# EAGLE design Qwiic Twist-BottomJig (EAGLE 9.2.1)
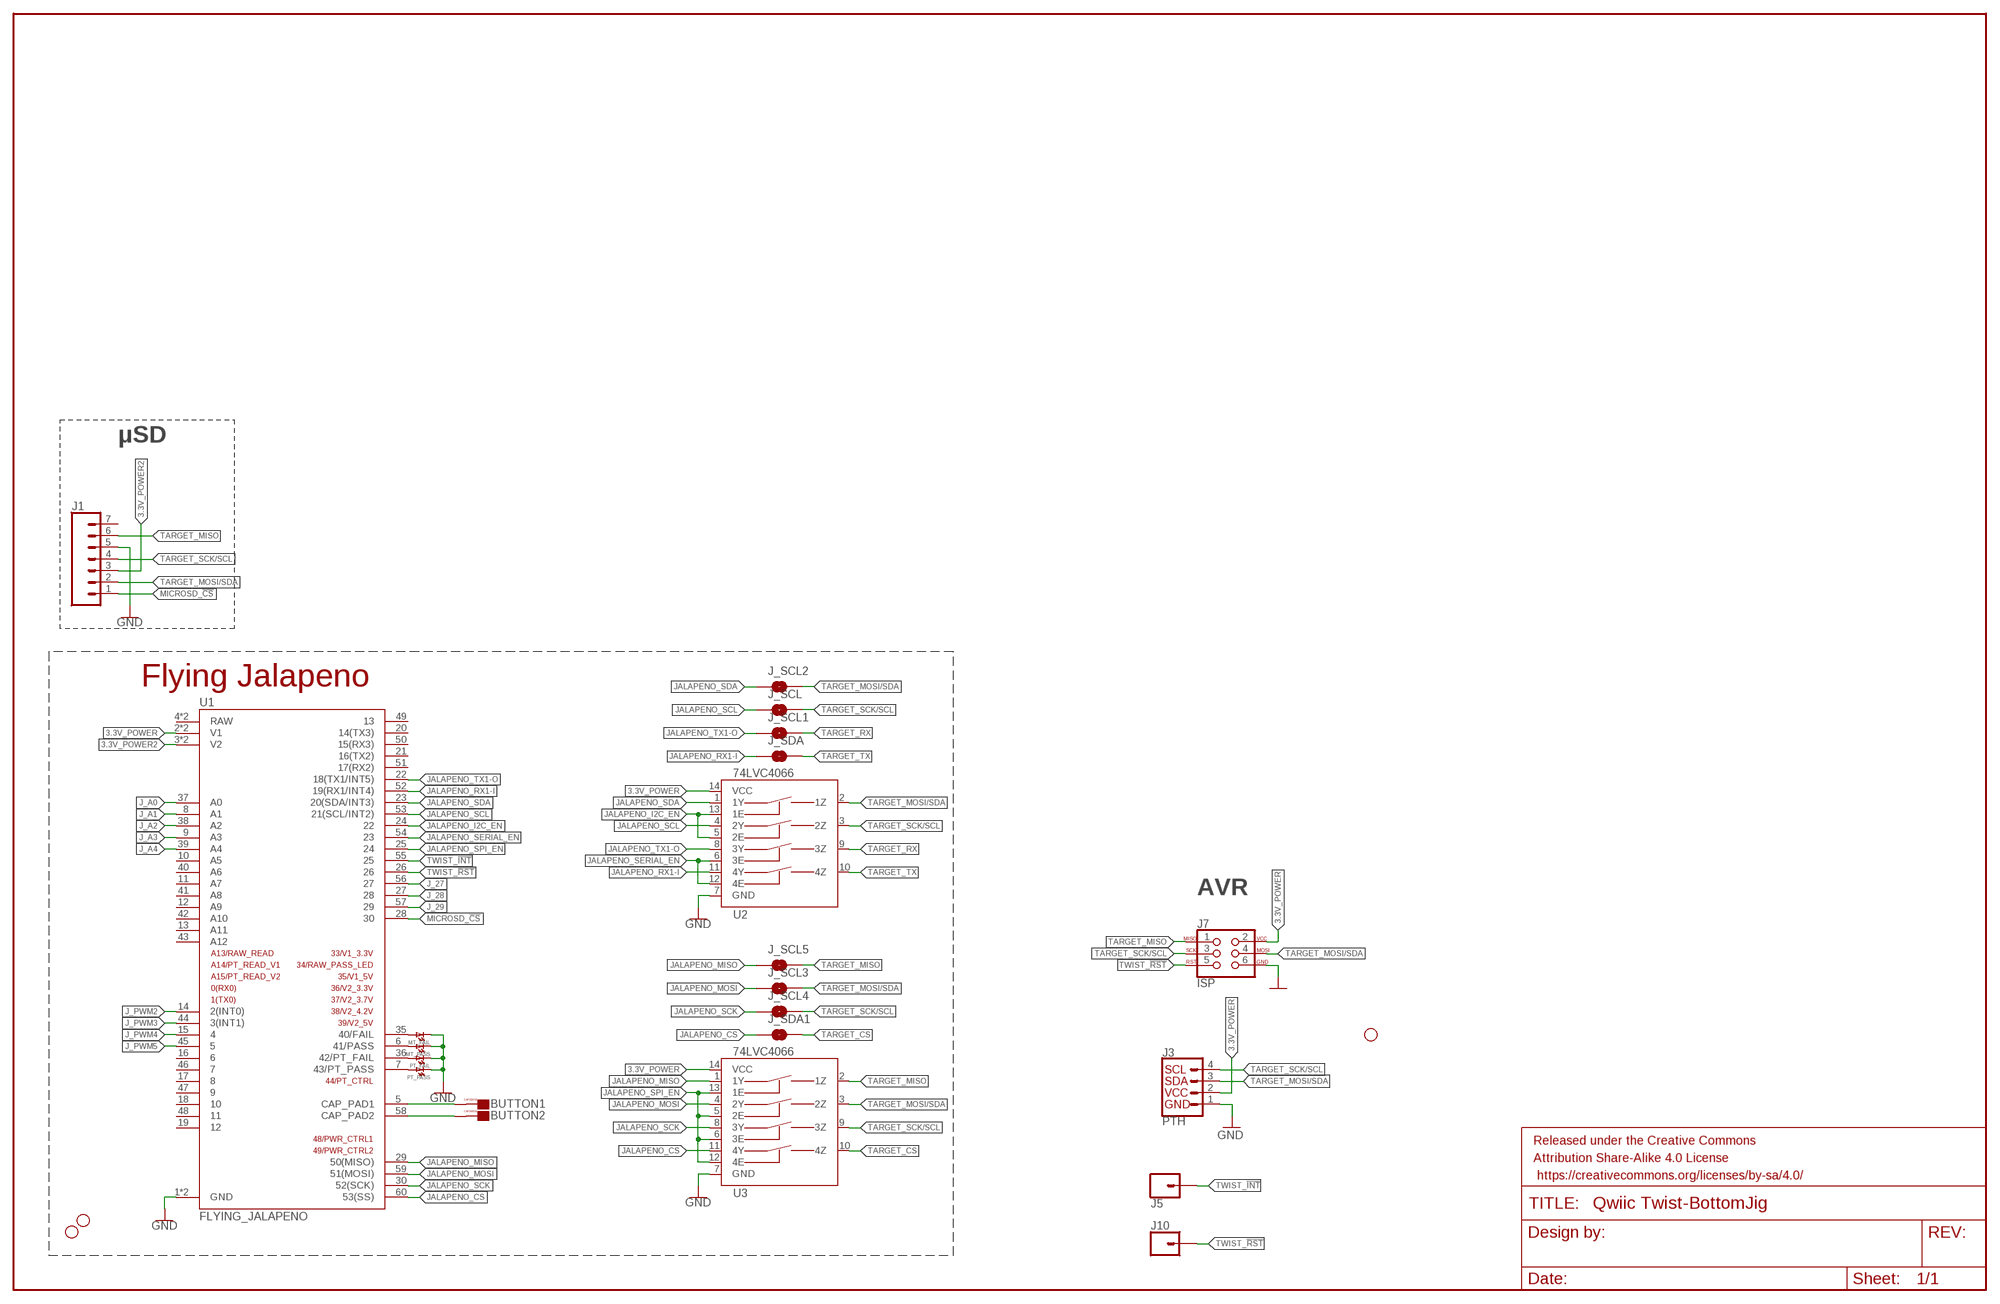
[diagram p0: schematic, sheet 1]

## Parts
BUTTON1  CAPSENSE_BUTTON_PAD_ONLY  [CAPSENSE_BUTTON_PADS_ONLY]
BUTTON2  CAPSENSE_BUTTON_PAD_ONLY  [CAPSENSE_BUTTON_PADS_ONLY]
FRAME2  FRAME-LEDGER  [CREATIVE_COMMONS]
H1  STAND-OFF  [STAND-OFF]
H3  STAND-OFF  [STAND-OFF]
J1  CONN_07  [1X07]
J3  PTH  I2C_STANDARD_NO_SILK  [1X04_NO_SILK]
J5  CONN_01PTH_NO_SILK_YES_STOP  [1X01_NO_SILK]
J7  ISP  AVR_SPI_PROG_3X2NS  [2X3-NS]
J10  CONN_01PTH_NO_SILK_YES_STOP  [1X01_NO_SILK]
J_SCL  JUMPER-SMT_2_NO_NO-SILK  [SMT-JUMPER_2_NO_NO-SILK]
J_SCL1  JUMPER-SMT_2_NO_NO-SILK  [SMT-JUMPER_2_NO_NO-SILK]
J_SCL2  JUMPER-SMT_2_NO_NO-SILK  [SMT-JUMPER_2_NO_NO-SILK]
J_SCL3  JUMPER-SMT_2_NO_NO-SILK  [SMT-JUMPER_2_NO_NO-SILK]
J_SCL4  JUMPER-SMT_2_NO_NO-SILK  [SMT-JUMPER_2_NO_NO-SILK]
J_SCL5  JUMPER-SMT_2_NO_NO-SILK  [SMT-JUMPER_2_NO_NO-SILK]
J_SDA  JUMPER-SMT_2_NO_NO-SILK  [SMT-JUMPER_2_NO_NO-SILK]
J_SDA1  JUMPER-SMT_2_NO_NO-SILK  [SMT-JUMPER_2_NO_NO-SILK]
JP3  STAND-OFF  [STAND-OFF]
MT_FAIL  LED1206  [LED-1206]
MT_PASS  LED1206  [LED-1206]
PT_FAIL  LED1206  [LED-1206]
PT_PASS  LED1206  [LED-1206]
U1  FLYING_JALAPENO  FLYING_JALAPENO_V3MALE  [FLYING_JALAPENO_V3_M]
U2  74LVC4066  74LVC4066_MUX_1:1_X4  [SO14]
U3  74LVC4066  74LVC4066_MUX_1:1_X4  [SO14]

## Nets
3.3V_POWER [VCC]: J3.2(VCC) J7.2 U1.2(V1) U1.32(V1) U2.14(VCC) U3.14(VCC)
3.3V_POWER2 [VCC]: J1.3 U1.3(V2) U1.33(V2)
BUTTON1 [CAPSENSE]: BUTTON1.CAPSENSE_PAD(CAPSENSE) U1.5(CAP_PAD1)
BUTTON2 [CAPSENSE]: BUTTON2.CAPSENSE_PAD(CAPSENSE) U1.58(CAP_PAD2)
GND: J1.5 J3.1(GND) J7.6 MT_FAIL.C MT_PASS.C PT_FAIL.C PT_PASS.C U1.1(GND) U1.31(GND) U2.7(GND) U3.7(GND)
J_27: U1.56
J_28: U1.27
J_29: U1.57
J_A0: U1.37(A0)
J_A1: U1.8(A1)
J_A2: U1.38(A2)
J_A3: U1.9(A3)
J_A4: U1.39(A4)
J_PWM2: U1.14(2(INT0))
J_PWM3: U1.44(3(INT1))
J_PWM4: U1.15
J_PWM5: U1.45
JALAPENO_CS: J_SDA1.1 U1.60(53(SS)) U3.11(4Y)
JALAPENO_I2C_EN: U1.24 U2.5(2E) U2.13(1E)
JALAPENO_MISO: J_SCL5.1 U1.29(50(MISO)) U3.1(1Y)
JALAPENO_MOSI: J_SCL3.1 U1.59(51(MOSI)) U3.4(2Y)
JALAPENO_RX1-I: J_SDA.1 U1.52(19(RX1/INT4)) U2.11(4Y)
JALAPENO_SCK: J_SCL4.1 U1.30(52(SCK)) U3.8(3Y)
JALAPENO_SCL: J_SCL.1 U1.53(21(SCL/INT2)) U2.4(2Y)
JALAPENO_SDA: J_SCL2.1 U1.23(20(SDA/INT3)) U2.1(1Y)
JALAPENO_SERIAL_EN: U1.54 U2.6(3E) U2.12(4E)
JALAPENO_SPI_EN: U1.25 U3.5(2E) U3.6(3E) U3.12(4E) U3.13(1E)
JALAPENO_TX1-O: J_SCL1.1 U1.22(18(TX1/INT5)) U2.8(3Y)
MICROSD_!CS!: J1.1 U1.28
N$1: PT_PASS.A U1.7(43/PT_PASS)
N$2: PT_FAIL.A U1.36(42/PT_FAIL)
N$4: MT_PASS.A U1.6(41/PASS)
N$5: MT_FAIL.A U1.35(40/FAIL)
TARGET_CS: J_SDA1.2 U3.10(4Z)
TARGET_MISO: J1.6 J7.1 J_SCL5.2 U3.2(1Z)
TARGET_MOSI/SDA: J1.2 J3.3(SDA) J7.4 J_SCL2.2 J_SCL3.2 U2.2(1Z) U3.3(2Z)
TARGET_RX: J_SCL1.2 U2.9(3Z)
TARGET_SCK/SCL: J1.4 J3.4(SCL) J7.3 J_SCL4.2 J_SCL.2 U2.3(2Z) U3.9(3Z)
TARGET_TX: J_SDA.2 U2.10(4Z)
TWIST_!INT!: J5.1 U1.55
TWIST_!RST!: J7.5 J10.1 U1.26
Unconnected: J1.7 U1.4(RAW) U1.10(A5) U1.11(A7) U1.12(A9) U1.13(A11) U1.16 U1.17 U1.18 U1.19 U1.20(14(TX3)) U1.21(16(TX2)) U1.34(RAW) U1.40(A6) U1.41(A8) U1.42(A10) U1.43(A12) U1.46 U1.47 U1.48 U1.49 U1.50(15(RX3)) U1.51(17(RX2))

## Notes on the sheet
- μSD
- Flying Jalapeno
- AVR

## Library data of the parts
BUTTON1 BUTTON2 = Testing:CAPSENSE_BUTTON_PAD_ONLY
FRAME2 = SparkFun-Aesthetics:FRAME-LEDGER: Schematic Frame - Ledger Standard 11x14 US Ledger frame
H1 H3 = SparkFun-Hardware:STAND-OFF: Stand Off
J1 = SparkFun-Connectors:CONN_07: Multi connection point. Often used as Generic Header-pin footprint for 0.1 inch spaced/style header connections On any of the 0.1 inch spaced packages, you can populate with these: Break Away Headers - Straight <https://www.sparkfun.com/products/116> (PRT-00116) Break Away Male Headers - Right Angle <https://www.sparkfun.com/products/553> (PRT-00553) Female Headers <https://www.sparkfun.com/products/115> (PRT-00115) Break Away Headers - Machine Pin <https://www.sparkfun.com/products/117> (PRT-00117) Break Away Female Headers - Swiss Machine Pin <https://www.sparkfun.com/products/743> (PRT-00743) For SCREWTERMINALS and SPRING TERMINALS visit here: Screw Terimnals on SparkFun.com <https://www.sparkfun.com/search/results?term=Screw+Terminals> (5mm/3.5mm/2.54mm spacing) This device is also useful as a general connection point to wire up your design to another part of your project. Our various solder wires solder well into these plated through hole pads. Hook-Up Wire - Assortment (Stranded, 22 AWG) <https://www.sparkfun.com/products/11375> (PRT-11375) Hook-Up Wire - Assortment (Solid Core, 22 AWG) <https://www.sparkfun.com/products/11367> (PRT-11367) View the entire wire category on our website here <https://www.sparkfun.com/categories/141> Special notes: Molex polarized connector foot print use with SKU : PRT-08231 with associated crimp pins and housings. 1MM SMD Version SKU: PRT-10208 NOTES ON THE VARIANTS LOCK and LOCK_LONGPADS... This footprint was designed to help hold the alignment of a through-hole component (i.e. 6-pin header) while soldering it into place. You may notice that each hole has been shifted either up or down by 0.005 of an inch from it's more standard position (which is a perfectly straight line). This slight alteration caused the pins (the squares in the middle) to touch the edges of the holes. Because they are alternating, it causes a "brace" to hold the component in place. 0.005 has proven to be the perfect amount of "off-center" position when using our standard breakaway headers. Although looks a little odd when you look at the bare footprint, once you have a header in there, the alteration is very hard to notice. Also,if you push a header all the way into place, it is covered up entirely on the bottom side.
J3 = SparkX:I2C_STANDARD: SparkFun I2C Standard Pinout Header SparkFun has standardized on a pinout for all I2C based sensor breakouts. This pinout allows I2C boards to be plugged directly into the headers on Arduino Uno compatible boards, and to be daisy chained easily. Example SparkFun Products: SparkFun Atmospheric Sensor Breakout - BME280 <https://www.sparkfun.com/products/13676> SparkFun Altitude/Pressure Sensor Breakout - MPL3115A2 <https://www.sparkfun.com/products/11084> SparkFun TOF Range Finder Sensor - VL6180 <https://www.sparkfun.com/products/12785>
J5 J10 = SparkFun-Connectors:CONN_01: Single connection point. Often used as Generic Header-pin footprint for 0.1 inch spaced/style header connections On any of the 0.1 inch spaced packages, you can populate with these: Break Away Headers - Straight <https://www.sparkfun.com/products/116> (PRT-00116) Break Away Male Headers - Right Angle <https://www.sparkfun.com/products/553> (PRT-00553) Female Headers <https://www.sparkfun.com/products/115> (PRT-00115) Break Away Headers - Machine Pin <https://www.sparkfun.com/products/117> (PRT-00117) Break Away Female Headers - Swiss Machine Pin <https://www.sparkfun.com/products/743> (PRT-00743) This device is also useful as a general connection point to wire up your design to another part of your project. Our various solder wires solder well into these plated through hole pads. Hook-Up Wire - Assortment (Stranded, 22 AWG) <https://www.sparkfun.com/products/11375> (PRT-11375) Hook-Up Wire - Assortment (Solid Core, 22 AWG) <https://www.sparkfun.com/products/11367> (PRT-11367) View the entire wire category on our website here <https://www.sparkfun.com/categories/141> Special notes: SMTSO-256-ET is a "flush mount" nut for a 4-40 screw. We mostly use this on specialty testbeds; it is a nice way to connect hardware to your PCB at an adjustable hieght. Also note, the SNAP packages are for using a snappable style connector. We sell a baggie of snaps and they are also used on two LilyPad designs: Snap Assortment - 30 pack (male and female) <https://www.sparkfun.com/products/11347> (DEV-11347) LilyPad Arduino SimpleSnap <https://www.sparkfun.com/products/10941> (DEV-10941) LilyPad SimpleSnap Protoboard <https://www.sparkfun.com/products/10940> (DEV-10940)
J7 = SparkFun-Connectors:AVR_SPI_PROG_3X2: AVR ISP 6 Pin This is the reduced ISP connector for AVR programming. Common on Arduino. This footprint will take up less PCB space and can be used with a 10-pin to 6-pin adapter such as SKU: BOB-08508 **Special note about "TEST_POINT" package. The stop mask is on the top side, so if you want your programming test points to be on the bottom of your board, make sure to place this package on the bottom side of the board. This also ensure that the orientation to program from the bottom side will be correct. SparkFun Products: SparkFun ISP Pogo Adapter <https://www.sparkfun.com/products/11591> - NS Tiny AVR Programmer <https://www.sparkfun.com/products/11801> -PTH
J_SCL J_SCL1-J_SCL5 J_SDA J_SDA1 = SparkFun-Jumpers:JUMPER-SMT_2_NO: Normally open jumper This jumper has two pads in close proximity to each other. Apply solder to close the connection. Round pads are easier to solder for beginners, but are a lot larger. SparkFun Product that uses the round pads: SparkFun EL Sequencer <https://www.sparkfun.com/products/12781>
JP3 = SparkFun:STAND-OFF: Stand Off
MT_FAIL MT_PASS PT_FAIL PT_PASS = Testing:LED: LEDs Standard schematic elements and footprints for 5mm, 3mm, 1206, and 0603 sized LEDs. 5mm - Spark Fun Electronics SKU : COM-00529 (and others)
U1 = Testing:FLYING_JALAPENO_V3
U2 U3 = Testing:74LVC4066_MUX_1:1_X4

## Net classes
1 VCC: width 0.381 mm
2 POWA: width 0.61 mm
3 CAPSENSE: width 0.508 mm

## Board
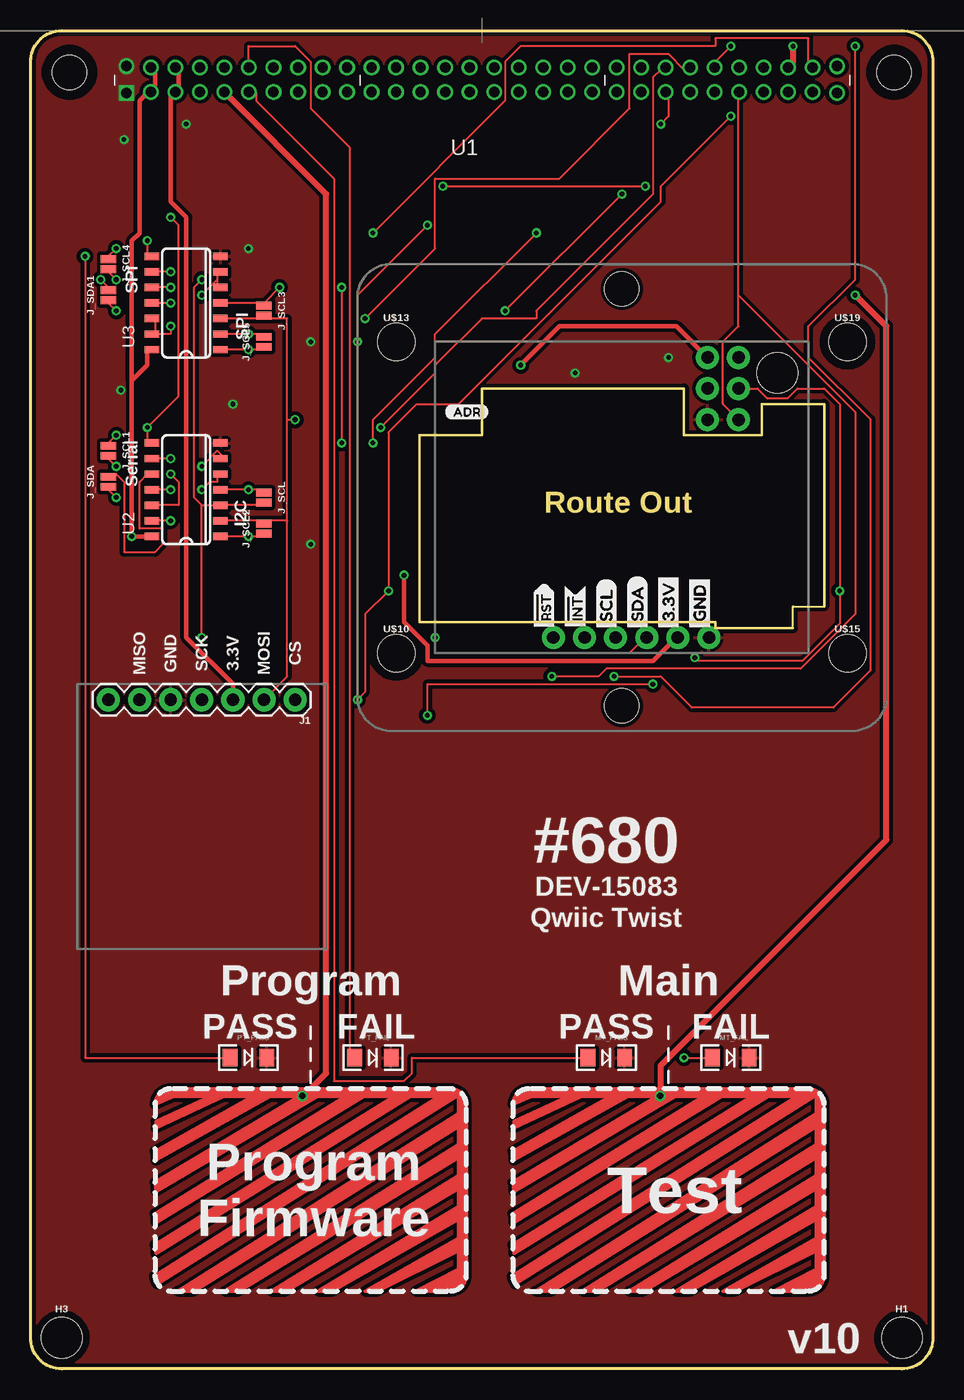
[diagram p1: board, top side]
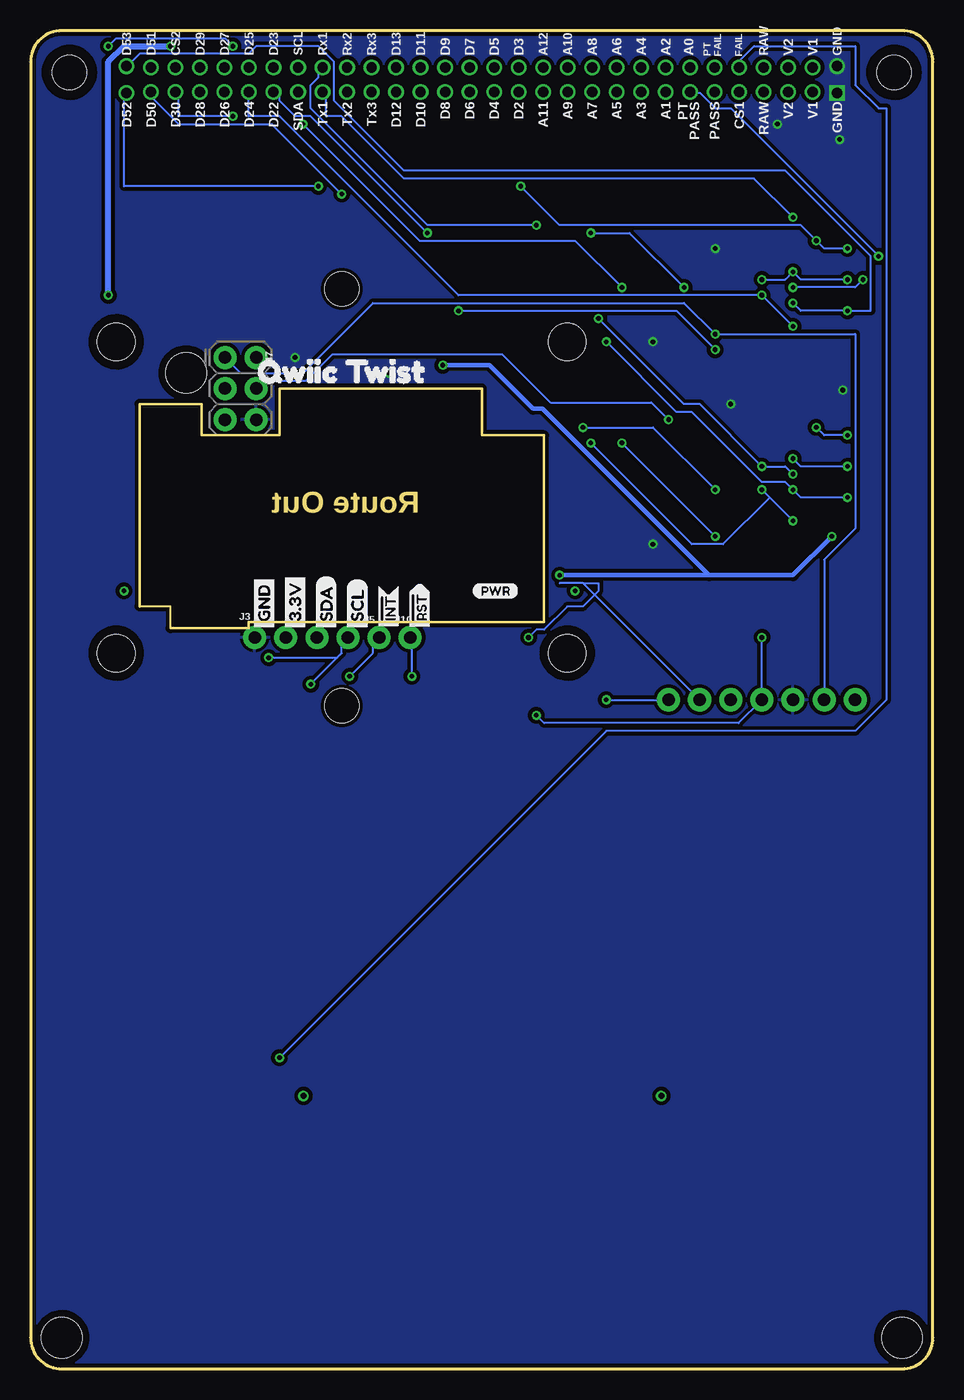
[diagram p2: board, bottom side, seen from below]

Size 73.66 x 109.22 mm. Coordinates in mm from the lower left corner, seen from the top.
Outline: 2.54,109.22 71.12,109.22 arc-90 73.66,106.68 73.66,2.54 arc-90 71.12,0 2.54,0 arc-90 0,2.54 0,106.68 arc-90 2.54,109.22
Outline: 31.75,76.2 36.83,76.2 36.83,80.01 53.34,80.01 53.34,76.2 59.69,76.2 59.69,78.74 64.77,78.74 64.77,62.23 62.23,62.23 62.23,60.45 55.88,60.45 55.88,60.96 31.75,60.96 31.75,76.2
Copper layers (1*16): Top 0.035mm / dielectric 1.5mm / Bottom 0.035mm
Design rules "SparkFun-2-layer-TIGHT": minimum track width 7mil, minimum drill 15mil, track to track 7mil, track to pad 7mil, pad to pad 7mil, via to via 7mil, smd to smd 7mil, copper to edge 7mil, drill to drill 7mil, minimum pad ring 7mil, minimum via ring 7mil, stop-mask expansion 4mil, vias tented up to drill 25mil, thermal gap 10mil

### Footprints (pad centres in the part's own frame; a part is rotated, then mirrored left to right if it is on the bottom)
CAPSENSE_BUTTON_PADS_ONLY = drill 0.508: CAPSENSE_PAD -0.686,7.036
STAND-OFF = hole 3.302: 0,0
1X07 = drill 1.016 pad 1.88: 1 0,0; 2 2.54,0; 3 5.08,0; 4 7.62,0; 5 10.16,0; 6 12.7,0; 7 15.24,0
1X04_NO_SILK = drill 1.016 pad 1.88: 1 0,0; 2 2.54,0; 3 5.08,0; 4 7.62,0
1X01_NO_SILK = drill 1.016 pad 1.88: 1 0,0
2X3-NS = drill 1.016 pad 1.88: 1 -2.54,-1.27; 2 -2.54,1.27; 3 0,-1.27; 4 0,1.27; 5 2.54,-1.27; 6 2.54,1.27
SMT-JUMPER_2_NO_NO-SILK = smd 0.635 x 1.27: 1 -0.406,0; 2 0.406,0
LED-1206 = smd 1.2 x 1.4: A -1.5,0; C 1.5,0
FLYING_JALAPENO_V3_M = drill 0.85 square: 1 -29,-5.1 | drill 0.85: 2 -27,-5; 3 -25,-5; 4 -23,-5; 5 -21,-5; 6 -19,-5; 7 -17,-5; 8 -15,-5; 9 -13,-5; 10 -11,-5; 11 -9,-5; 12 -7,-5; 13 -5,-5; 14 -3,-5; 15 -1,-5; 16 1,-5; 17 3,-5; 18 5,-5; 19 7,-5; 20 9,-5; 21 11,-5; 22 13,-5; 23 15,-5; 24 17,-5; 25 19,-5; 26 21,-5; 27 23,-5; 28 25,-5; 29 27,-5; 30 29,-5.1; 31 -29,-2.9; 32 -27,-3; 33 -25,-3; 34 -23,-3; 35 -21,-3; 36 -19,-3; 37 -17,-3; 38 -15,-3; 39 -13,-3; 40 -11,-3; 41 -9,-3; 42 -7,-3; 43 -5,-3; 44 -3,-3; 45 -1,-3; 46 1,-3; 47 3,-3; 48 5,-3; 49 7,-3; 50 9,-3; 51 11,-3; 52 13,-3; 53 15,-3; 54 17,-3; 55 19,-3; 56 21,-3; 57 23,-3; 58 25,-3; 59 27,-3; 60 29,-2.9 | hole 2.794: 33.655,-3.404; -33.655,-3.404
SO14 = smd 0.6 x 1.2: 1 -3.175,-2.8; 2 -1.905,-2.8; 3 -0.635,-2.8; 4 0.635,-2.8; 5 1.905,-2.8; 6 3.175,-2.8; 7 4.445,-2.8; 8 4.445,2.8; 9 3.175,2.8; 10 1.905,2.8; 11 0.635,2.8; 12 -0.635,2.8; 13 -1.905,2.8; 14 -3.175,2.8
STAND-OFF-TIGHT = hole 3.048: 0,0
NUBBIN_LOCKER = hole 2.794: 0,0

### Placement (x,y rotation side)
BUTTON1  22.86,15.24 0 top
BUTTON2  52.07,15.24 0 top
FRAME2  -15.24,-26.67 0 top  (outside the outline)
H1  71.12,2.54 0 top
H3  2.54,2.54 0 top
J1  21.59,54.61 180 top
J3  55.37,59.69 0 bottom
J5  45.21,59.69 0 bottom
J7  56.52,80.01 270 bottom
J10  42.67,59.69 0 bottom
J_SCL  19.05,71.12 270 top
J_SCL1  6.35,74.93 270 top
J_SCL2  19.05,68.58 90 top
J_SCL3  19.05,86.36 270 top
J_SCL4  6.35,90.17 270 top
J_SCL5  19.05,83.82 90 top
J_SDA  6.35,72.39 90 top
J_SDA1  6.35,87.63 90 top
JP3  60.96,81.28 0 bottom
MT_FAIL  57.15,25.4 0 top
MT_PASS  46.99,25.4 0 top
PT_FAIL  27.94,25.4 0 top
PT_PASS  17.78,25.4 0 top
U1  36.83,109.22 0 top
U2  12.7,71.12 90 top
U3  12.7,86.36 90 top
U$3  [GND1]  54.61,60.07 90 top
U$4  [3#3V2]  52.07,60.07 90 top
U$5  [SDA8]  49.53,60.07 90 top
U$6  [SCL9]  46.99,60.07 90 top
U$7  [RST#-[>]  41.91,59.94 90 bottom
U$9  [INT#-[<]  44.45,59.94 90 bottom
U$10  [STAND-OFF-TIGHT]  29.84,58.42 0 top
U$11  [INT#-[<]  44.45,59.94 90 top
U$13  [STAND-OFF-TIGHT]  29.84,83.82 0 top
U$14  [QWIIC_TWIST1]  56.77,81.41 0 bottom
U$15  [STAND-OFF-TIGHT]  66.67,58.42 0 top
U$16  [RST#-[>]  41.91,59.94 90 top
U$17  [PWR-()-03]  37.59,63.5 0 bottom
U$18  [ADR-()-03]  33.78,78.11 0 top
U$19  [STAND-OFF-TIGHT]  66.67,83.82 0 top
U$20  [NUBBIN_LOCKER]  48.26,54.1 0 top
U$21  [3#3V2]  52.07,60.07 90 bottom
U$22  [GND1]  54.61,60.07 90 bottom
U$23  [NUBBIN_LOCKER]  48.26,88.14 0 top
U$26  [SCL9]  46.99,60.07 90 bottom
U$27  [SDA8]  49.53,60.07 90 bottom

### Tracks (layer width: path | path; a pad name or v marks a point on that pad's centre or on a via)
3.3V_POWER  (via drill 0.38)
  Top 0.381: U1.32 10.16,106.05 10.16,104.78 U1.2 9.53,104.14 8.89,103.5 8.89,92.71 8.26,92.08 8.26,80.64 | U2.14 v8.26,67.94 8.26,80.64 | 8.26,80.64 9.53,81.92 9.53,83.19 U3.14 | J7.2 52.7,85.09 43.18,85.09 v40.01,81.92 | v30.48,64.77 30.48,60.96 32.38,59.05 32.38,57.78 50.8,57.78 52.7,59.69 J3.2
  Bottom 0.381: 18.29,64.77 11.43,64.77 v8.26,67.94 | 18.29,64.77 v30.48,64.77 | v40.01,81.92 36.2,81.92 32.64,78.36 31.88,78.36 18.29,64.77
3.3V_POWER2
  Top 0.381: U1.33 12.06,106.05 12.06,104.78 U1.3 11.43,104.14 11.43,95.25 12.7,93.98 12.7,59.69 16.51,55.88 J1.3
BUTTON1
  Top 0.508: U1.5 15.88,104.14 24.13,95.89 24.13,24.13 22.23,22.23 BUTTON1.CAPSENSE_PAD
BUTTON2  (via drill 0.38)
  Top 0.508: v62.23,107.95 62.23,106.68 U1.58 | v67.31,87.63 69.85,85.09 69.85,43.18 51.44,24.77 51.44,22.23 BUTTON2.CAPSENSE_PAD
  Bottom 0.508: v62.23,107.95 66.04,107.95 67.31,106.68 v67.31,87.63
GND  (via drill 0.38)
  other vias: 17.78,91.44 16.51,78.74 22.86,83.82 22.86,67.31 12.7,101.6 7.62,100.33 7.37,79.88 44.45,81.28 52.07,82.55
  pour Top (isolate 0.305): 0,109.22 73.66,109.22 73.66,0 0,0
  pour Bottom (isolate 0.305): 0,109.22 73.66,109.22 73.66,0 0,0
JALAPENO_CS  (via drill 0.38)
  Top 0.178: v11.43,87 U3.11 | v6.99,86.36 6.35,87 J_SDA1.1
  Bottom 0.178: v11.43,87 10.79,86.36 v6.99,86.36 5.08,86.36 5.08,90.81 12.06,97.79 43.18,97.79 48.9,103.5 48.9,106.68 50.16,107.95 55.24,107.95 55.88,107.31 64.77,107.31 65.41,106.68 U1.60
JALAPENO_I2C_EN  (via drill 0.38)
  Top 0.178: v11.43,69.22 U2.13 | v13.97,71.75 14.61,72.39 15.24,72.39 15.24,73.03 U2.5 | v41.27,92.71 33.02,84.45 33.02,82.55 27.94,77.47 v27.94,75.56
  Bottom 0.178: v13.97,71.75 13.34,71.12 | 13.34,71.12 v11.43,69.22 | v41.27,92.71 50.8,102.23 52.07,102.23 53.34,103.5 53.34,104.14 U1.24 | v27.94,75.56 19.68,67.31 17.14,67.31 13.34,71.12
JALAPENO_MISO  (via drill 0.38)
  Top 0.178: U3.1 v17.78,83.19 19.05,83.19 J_SCL5.1 | v48.26,95.89 v38.73,86.36
  Bottom 0.178: v17.78,83.19 20.95,86.36 v38.73,86.36 | v48.26,95.89 53.98,101.6 61.59,101.6 64.14,104.14 U1.29
JALAPENO_MOSI  (via drill 0.38)
  Top 0.178: 19.05,87 U3.4 | v20.32,88.27 19.05,87 | v27.94,92.71 38.73,103.5 38.73,106.68 40.01,107.95 55.88,107.95 55.88,108.58 63.5,108.58 63.5,106.68 U1.59 | 19.05,87 J_SCL3.1
  Bottom 0.178: v20.32,88.27 24.77,92.71 v27.94,92.71
JALAPENO_RX1-I  (via drill 0.38)
  Top 0.178: v11.43,71.75 U2.11 | v6.99,71.12 6.35,71.75 J_SDA.1 | v32.38,93.34 26.67,87.63 v26.67,83.82
  Bottom 0.178: v6.99,71.12 10.79,71.12 v11.43,71.75 12.06,72.39 13.97,72.39 19.68,78.11 20.95,78.11 v26.67,83.82 | v32.38,93.34 41.27,93.34 50.8,102.87 50.8,104.78 50.16,105.41 50.16,106.05 U1.52
JALAPENO_SCK  (via drill 0.38)
  Top 0.178: v9.53,92.08 9.53,90.81 U3.8 | v6.99,91.44 6.35,90.81 J_SCL4.1 | v33.66,96.52 v50.16,96.52
  Bottom 0.178: v6.99,91.44 8.89,91.44 v9.53,92.08 10.79,93.34 30.48,93.34 v33.66,96.52 | v50.16,96.52 66.04,96.52 66.04,103.5 U1.30
JALAPENO_SCL  (via drill 0.38)
  Top 0.178: U2.4 v17.78,71.75 19.05,71.75 J_SCL.1 | v28.57,76.83 33.02,81.28 33.02,81.92 36.83,85.72 41.27,85.72 41.27,86.36 50.8,95.89 50.8,105.41 51.44,106.05 U1.53
  Bottom 0.178: v17.78,71.75 22.86,76.83 v28.57,76.83
JALAPENO_SDA  (via drill 0.38)
  Top 0.178: U2.1 v17.78,67.94 19.05,67.94 J_SCL2.1 | v25.4,88.27 v25.4,75.56 | v51.44,101.6 52.07,102.23 52.07,104.14 U1.23
  Bottom 0.178: v25.4,75.56 v17.78,67.94 | v25.4,88.27 29.21,92.08 41.91,92.08 v51.44,101.6
JALAPENO_SERIAL_EN  (via drill 0.38)
  Top 0.178: U2.12 12.06,70.48 12.06,72.39 v11.43,73.03 | v13.97,73.66 15.24,74.93 15.88,74.3 U2.6 | v27.3,85.72 33.02,91.44 33.02,97.16 43.18,97.16 48.9,102.87 48.9,107.31 52.07,107.31 53.34,106.05 U1.54
  Bottom 0.178: v11.43,73.03 12.06,73.66 v13.97,73.66 19.05,78.74 20.32,78.74 v27.3,85.72
JALAPENO_SPI_EN  (via drill 0.38)
  Top 0.178: 10.16,84.45 10.16,85.72 U3.12 | 15.24,88.9 15.24,89.53 U3.6 | 15.24,88.9 15.24,88.27 U3.5 | 10.16,84.45 11.43,84.45 v11.43,85.09 | 15.24,88.9 v13.97,87.63 | 10.16,84.45 U3.13
  Bottom 0.178: v11.43,85.09 v13.97,87.63 38.73,87.63 53.34,102.23 55.88,102.23 55.88,104.14 U1.25
JALAPENO_TX1-O  (via drill 0.38)
  Top 0.178: v6.99,76.2 6.35,75.56 J_SCL1.1 | U2.8 9.53,75.56 v9.53,76.83 12.06,79.38 12.06,93.34 v11.43,93.98
  Bottom 0.178: v9.53,76.83 8.89,76.2 v6.99,76.2 | v11.43,93.98 14.61,97.16 43.18,97.16 48.26,102.23 49.53,102.23 49.53,104.14 U1.22
MICROSD_!CS!  (via drill 0.38)
  Top 0.178: v57.15,102.23 51.44,96.52 51.44,95.25 34.91,78.73 31.48,78.73 29.21,76.45 v29.21,63.5 27.3,61.59 27.3,55.24 v26.67,54.61
  Bottom 0.178: v57.15,102.23 61.59,102.23 61.59,104.14 U1.28 | v26.67,54.61 J1.1
N$1  (via drill 0.38)
  Top 0.178: PT_PASS.A 4.45,25.4 v4.45,90.81
  Bottom 0.178: v4.45,90.81 16.51,102.87 17.78,102.87 19.05,104.14 19.68,104.14 U1.7
N$2
  Top 0.178: PT_FAIL.A 26.04,25.4 26.04,99.69 22.86,102.87 22.86,106.68 21.59,107.95 17.78,107.95 17.78,106.68 U1.36
N$4
  Top 0.178: MT_PASS.A 31.11,25.4 31.11,24.13 30.48,23.5 24.77,23.5 24.77,97.16 18.41,103.5 18.41,104.14 U1.6
N$5  (via drill 0.38)
  Top 0.178: v53.34,25.4 MT_FAIL.A
  Bottom 0.178: v53.34,25.4 26.67,52.07 6.35,52.07 3.81,54.61 3.81,102.87 4.45,102.87 6.35,104.78 6.35,107.95 14.61,107.95 15.88,106.68 U1.35
TARGET_CS  (via drill 0.38)
  Top 0.178: v11.43,88.27 U3.10 | v5.71,88.9 6.35,88.27 J_SDA1.2
  Bottom 0.178: v11.43,88.27 6.35,88.27 v5.71,88.9
TARGET_MISO  (via drill 0.38)
  Top 0.178: U3.2 v17.78,84.45 19.05,84.45 J_SCL5.2
  Bottom 0.178: J7.1 56.52,81.28 51.44,81.28 45.72,87 20.32,87 v17.78,84.45 6.35,84.45 6.35,68.58 8.89,66.04 J1.6
TARGET_MOSI/SDA  (via drill 0.38)
  Top 0.178: 19.05,85.72 U3.3 | 19.05,69.22 U2.2 | 20.95,69.22 19.05,69.22 | 20.95,69.22 20.95,56.52 J1.2 | 19.05,69.22 J_SCL2.2 | 19.05,85.72 20.95,85.72 20.95,77.47 | 20.95,69.22 20.95,77.47 | 19.05,85.72 J_SCL3.2 | 20.95,77.47 v21.59,77.47 | v33.02,59.69 33.02,58.42 48.9,58.42 50.16,59.69 J3.3
  Bottom 0.178: 28.57,64.14 30.48,64.14 | J1.2 28.57,64.14 | J7.4 54.61,80.64 51.18,80.64 49.02,82.8 35.18,82.8 31.24,78.87 22.99,78.87 v21.59,77.47 | v33.02,59.69 32.38,60.33 31.75,60.33 29.84,62.23 28.57,62.23 27.3,63.5 27.3,64.14 28.57,64.14
TARGET_RX  (via drill 0.38)
  Top 0.178: v11.43,74.3 U2.9 | v6.99,73.66 6.35,74.3 J_SCL1.2
  Bottom 0.178: v11.43,74.3 10.79,73.66 v6.99,73.66
TARGET_SCK/SCL  (via drill 0.38)
  Top 0.178: v11.43,89.53 U3.9 | v6.99,88.9 6.35,89.53 J_SCL4.2 | J_SCL.2 19.05,70.48 U2.3 13.97,70.48 | v13.97,59.69 13.97,70.48 | v13.97,88.9 13.34,88.27 13.34,71.12 13.97,70.48 | v50.8,55.88 32.38,55.88 v32.38,53.34 | J7.3 59.33,80.01 60.1,79.23 61.82,79.23 62.59,80.01 64.77,80.01 66.04,78.74 v66.04,63.5 66.04,60.83 63,57.78 54.48,57.78 v54.23,58.04
  Bottom 0.178: v6.99,88.9 10.79,88.9 v11.43,89.53 12.06,88.9 v13.97,88.9 | v13.97,59.69 J1.4 15.88,52.7 31.75,52.7 v32.38,53.34 | v50.8,55.88 48.64,58.04 | J3.4 48.26,59.69 48.26,58.42 48.39,58.29 48.64,58.04 | v54.23,58.04 48.64,58.04
TARGET_TX
  Top 0.178: U2.10 9.53,73.03 8.89,72.39 8.89,68.58 10.79,68.58 10.79,67.31 10.16,66.67 7.62,66.67 7.62,72.39 6.99,73.03 6.35,73.03 J_SDA.2
TWIST_!INT!  (via drill 0.38)
  Top 0.178: v57.15,107.95 55.88,106.68 U1.55 | v67.31,107.95 67.31,88.9 63.5,85.09 63.5,82.55 68.58,77.47 68.58,57.02 65.53,53.98 53.98,53.98 51.44,56.52 v47.62,56.52
  Bottom 0.178: v57.15,107.95 57.78,108.58 66.67,108.58 v67.31,107.95 | v47.62,56.52 45.72,58.42 45.72,59.69 J5.1
TWIST_!RST!  (via drill 0.38)
  Top 0.178: 57.78,87.63 57.78,85.09 56.52,83.82 56.52,78.74 J7.5 | 57.78,87.63 57.78,104.14 U1.26 | v42.55,56.52 46.35,56.52 46.99,57.15 62.87,57.15 67.31,61.59 67.31,78.11 57.78,87.63
  Bottom 0.178: v42.55,56.52 42.55,59.69 J10.1

### Text on the board
Dimension: Route Out
tPlace: SPI | SPI | Serial | I2C | MISO | GND | SCK | 3.3V | MOSI | CS | #680 | DEV-15083 | Qwiic Twist | Program | Main | PASS | FAIL | PASS | FAIL | Program / Firmware | Test | v10